# Altium schematic sheet Shutdown_2019_v1.1_7.SchDoc: Shutdown_2019_v1.1
size 453 x 301 mm; Date: 1/4/2019 10:42:24 PM; SheetNumber: 8; GateName_1: G$1; SymbolName_1: FRAME_B_L; LibraryName: frames; DeviceSetName: FRAME_B_L; GateName_2: G$2; SymbolName_2: DOCFIELD
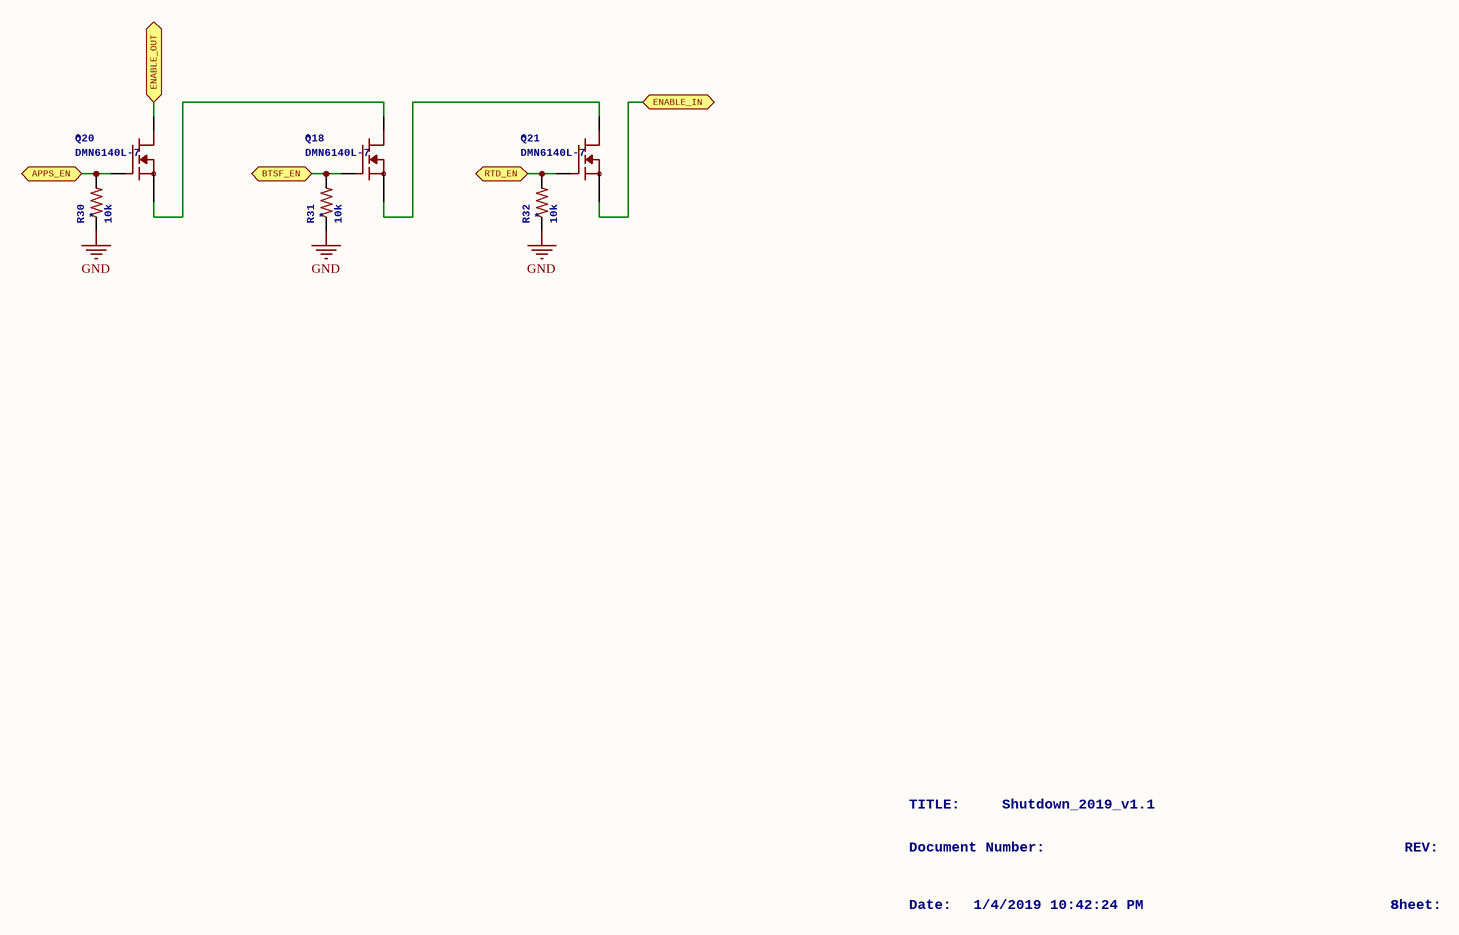
[diagram p0: Shutdown_2019_v1.1_7.SchDoc]

## Parts
Q18  DMN6140L-7  [SOT23]
Q20  DMN6140L-7  [SOT23]
Q21  DMN6140L-7  [SOT23]
R30  10k  [R0603]
R31  10k  [R0603]
R32  10k  [R0603]

## Ports
APPS_EN, BTSF_EN, ENABLE_IN, ENABLE_OUT, RTD_EN

## Nets
GND: R30.1 R31.1 R32.1
APPS_EN: Q20.1(G) R30.2 ; port APPS_EN
BTSF_EN: Q18.1(G) R31.2 ; port BTSF_EN
ENABLE_IN: Q21.2(S) ; port ENABLE_IN
ENABLE_OUT: Q20.3(D) ; port ENABLE_OUT
RTD_EN: Q21.1(G) R32.2 ; port RTD_EN
NetQ18_2: Q18.2(S) Q21.3(D)
NetQ18_3: Q18.3(D) Q20.2(S)

## Notes on the sheet
- TITLE:
- Document Number:
- Shutdown_2019_v1.1
- REV:
- Date:
- 1/4/2019 10:42:24 PM
- Sheet:
- 8
- 1
- 2
- 3
- 4
- 5
- 6
- 7
- 9
- A
- B
- C
- D
- E
- F

## Library data of the parts
Q18 Q20 Q21 = DMN6140L-7: DMN6140L-7 Vgs(th) = 3V, Rds(on) = 140mOhm, Vds(max) = 60V; GateName_1: G$1; SymbolName_1: N-MOSFET-GDS; LibraryName: TRANS; DeviceSetName: DMN6140L-7; NAME: *
R30-R32 = R-US_R0603: RESISTOR, American symbol; GateName_1: G$1; SymbolName_1: R-US; DeviceSetName: R-US_; DeviceName: R0603; LibraryName: rcl; NAME: *; SPICEPREFIX: R